# EAGLE schematic untitled (EAGLE 9.5.0)
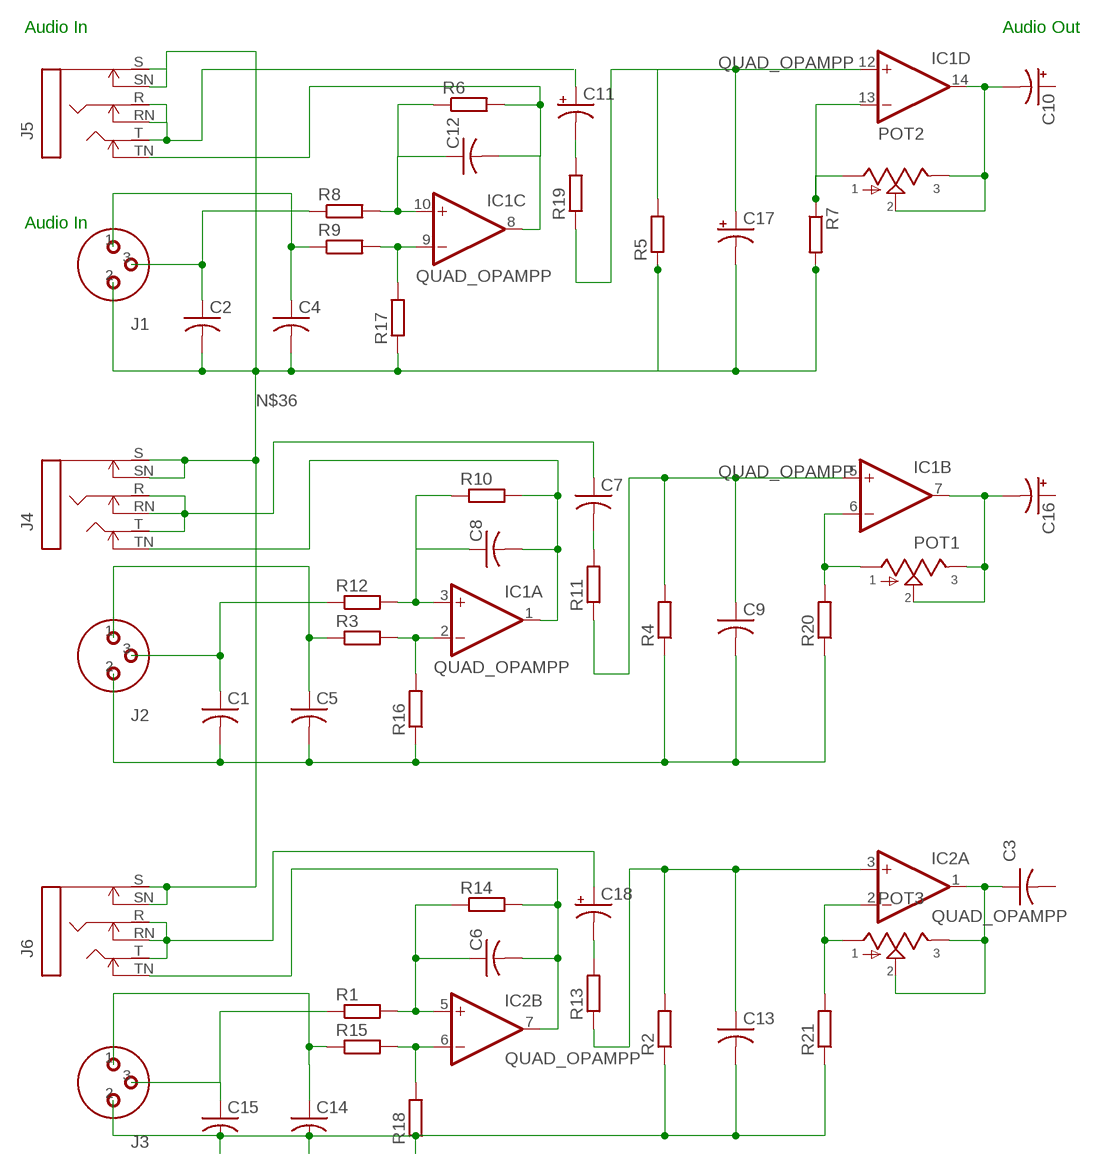
[diagram p0: schematic, sheet 1]

## Parts
C1  C-US025-030X050  [C025-030X050]
C2  C-US025-030X050  [C025-030X050]
C3  C-US025-030X050  [C025-030X050]
C4  C-US025-030X050  [C025-030X050]
C5  C-US025-030X050  [C025-030X050]
C6  C-US025-030X050  [C025-030X050]
C7  C-US025-030X050  [C025-030X050]
C8  C-US025-030X050  [C025-030X050]
C9  C-US025-030X050  [C025-030X050]
C10  CPOL-USE1.8-4  [E1,8-4]
C11  CPOL-USE1.8-4  [E1,8-4]
C12  C-US025-030X050  [C025-030X050]
C13  C-US025-030X050  [C025-030X050]
C14  C-US025-030X050  [C025-030X050]
C15  C-US025-030X050  [C025-030X050]
C16  CPOL-USE1.8-4  [E1,8-4]
C17  CPOL-USE1.8-4  [E1,8-4]
C18  CPOL-USE1.8-4  [E1,8-4]
IC1  QUAD_OPAMPP  [DIL14]
IC2  QUAD_OPAMPP  [DIL14]
J1  XLR  [XLR_PADS]
J2  XLR  [XLR_PADS]
J3  XLR  [XLR_PADS]
J4  STEREOSWS  [NMJ6HC-S]
J5  STEREOSWS  [NMJ6HC-S]
J6  STEREOSWS  [NMJ6HC-S]
POT1  POT  [POT]
POT2  POT  [POT]
POT3  POT  [POT]
R1  R-EU_0204/7  [0204/7]
R2  R-EU_0204/7  [0204/7]
R3  R-EU_0204/7  [0204/7]
R4  R-EU_0204/7  [0204/7]
R5  R-EU_0204/7  [0204/7]
R6  R-EU_0204/7  [0204/7]
R7  R-EU_0204/7  [0204/7]
R8  R-EU_0204/7  [0204/7]
R9  R-EU_0204/7  [0204/7]
R10  R-EU_0204/7  [0204/7]
R11  R-EU_0204/7  [0204/7]
R12  R-EU_0204/7  [0204/7]
R13  R-EU_0204/7  [0204/7]
R14  R-EU_0204/7  [0204/7]
R15  R-EU_0204/7  [0204/7]
R16  R-EU_0204/7  [0204/7]
R17  R-EU_0204/7  [0204/7]
R18  R-EU_0204/7  [0204/7]
R19  R-EU_0204/7  [0204/7]
R20  R-EU_0204/7  [0204/7]
R21  R-EU_0204/7  [0204/7]

## Nets
N$1: C17.+ IC1.12(D:+IN) R5.2 R19.1
N$2: C13.2 C14.2 C15.2 J3.2 R2.1 R18.1 R21.1
N$3: J5.R J5.RN J5.T
N$4: C12.1 IC1.10(C:+IN) R6.1 R8.2
N$5: IC1.9(C:-IN) R9.2 R17.2
N$6: C11.- R19.2
N$7: IC1.13(D:-IN) POT2.1 R7.1
N$8: C11.+
N$9: C10.- IC1.14(D:OUT) POT2.2 POT2.3
N$10: C4.1 J1.1 R9.1
N$11: C2.1 J1.3 R8.1
N$12: C7.1 J4.R J4.RN J4.T
N$13: C1.2 C5.2 C9.2 J2.2 R4.1 R16.1 R20.1
N$14: C12.2 IC1.8(C:OUT) J5.TN R6.2
N$15: IC1.2(A:-IN) R3.2 R16.2
N$16: C5.1 J2.1 R3.1
N$17: C1.1 J2.3 R12.1
N$18: C8.1 IC1.3(A:+IN) R10.1 R12.2
N$19: C7.2 R11.2
N$20: C18.+ J6.R J6.RN J6.T
N$21: C8.2 IC1.1(A:OUT) J4.TN R10.2
N$22: C9.1 IC1.5(B:+IN) R4.2 R11.1
N$23: IC1.6(B:-IN) POT1.1 R20.2
N$24: C16.- IC1.7(B:OUT) POT1.2 POT1.3
N$25: IC2.2(A:-IN) POT3.1 R21.2
N$26: C3.1 IC2.1(A:OUT) POT3.2 POT3.3
N$29: C6.1 IC2.5(B:+IN) R1.2 R14.1
N$30: IC2.6(B:-IN) R15.2 R18.2
N$31: C15.1 J3.3 R1.1
N$32: C14.1 J3.1 R15.1
N$33: C6.2 IC2.7(B:OUT) J6.TN R14.2
N$34: C18.- R13.2
N$35: C13.1 IC2.3(A:+IN) R2.2 R13.1
N$36: C2.2 C4.2 C17.- J1.2 J4.S J4.SN J5.S J5.SN J6.S J6.SN R5.1 R7.2 R17.1
Unconnected: C3.2 C10.+ C16.+ IC2.8(C:OUT) IC2.9(C:-IN) IC2.10(C:+IN) IC2.12(D:+IN) IC2.13(D:-IN) IC2.14(D:OUT)

## Notes on the sheet
- Audio In | Audio Out
- Audio In

## Power pins joined to a net without a drawn wire
V+: IC1.4(P:V+) IC2.4(P:V+)
V-: IC1.11(P:V-) IC2.11(P:V-)

## Library data of the parts
C1-C9 C12-C15 = adafruit:C-US: CAPACITOR, American symbol
C10 C11 C16-C18 = adafruit:CPOL-US: POLARIZED CAPACITOR, American symbol
IC1 IC2 = adafruit:QUAD_OPAMP: OP AMP Standard quad package
J1-J3 = gm-jacks:XLR
J4-J6 = gm-jacks:STEREOSW
POT1-POT3 = gm-pots:POT: Potentiometers the arrow indicates the clockwise motion of th wiper (lug 2) fully counter clockwise there is no resistance between lugs 1 and 2 fully clockwise the resistance between lugs 1 and 2 is the value of the pot
R1-R21 = rcl:R-EU_: RESISTOR, European symbol; SPICEPREFIX: R